# EAGLE design Eurorack_current_measure_PCB (EAGLE 7.1.0)
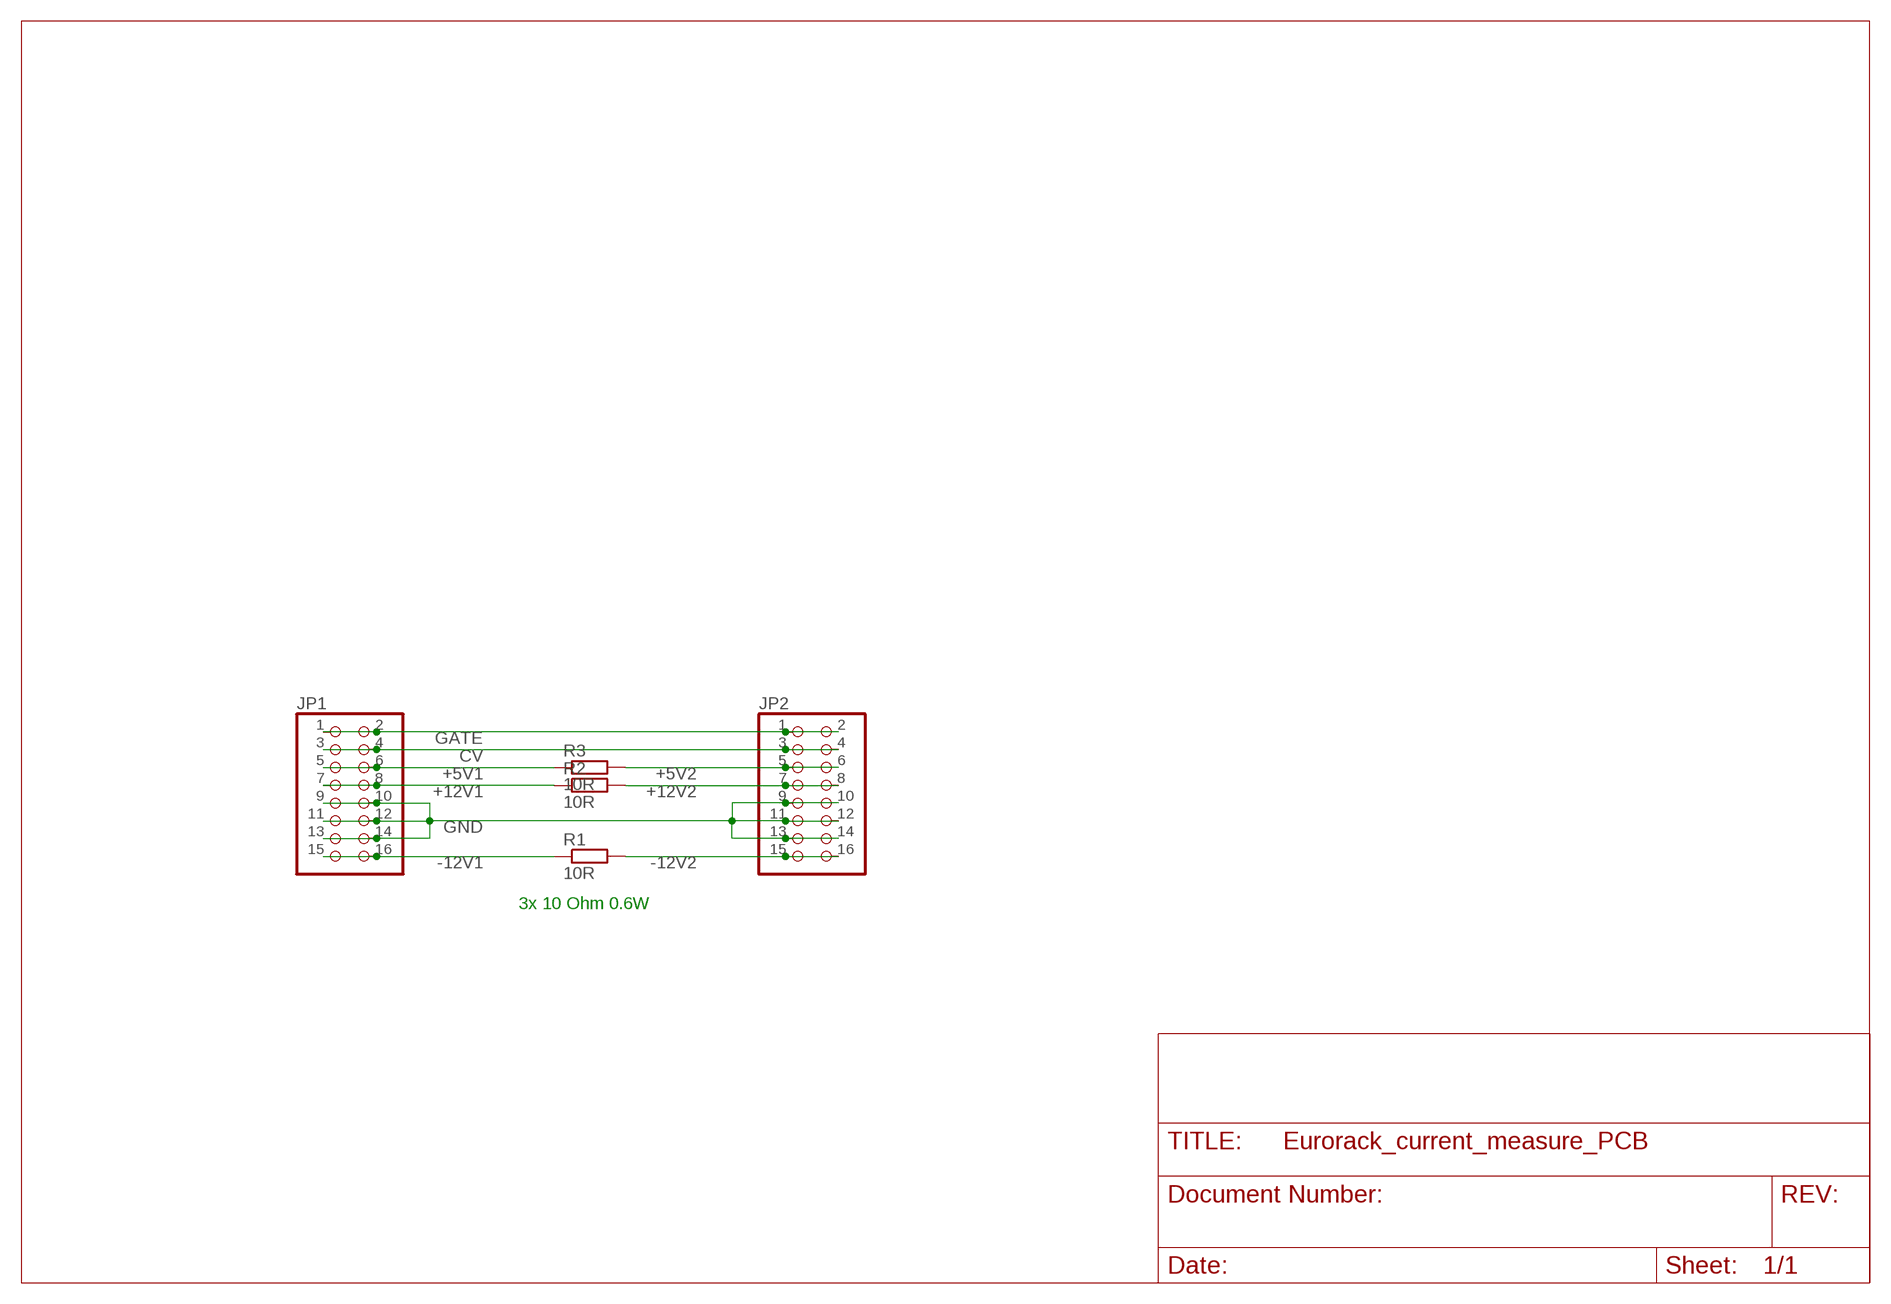
[diagram p0: schematic, sheet 1]

## Parts
JP1  PINHD-2X8  [2X08]
JP2  PINHD-2X8  [2X08]
R1  10R  R-EU_0207/10  [0207/10]
R2  10R  R-EU_0207/10  [0207/10]
R3  10R  R-EU_0207/10  [0207/10]

## Nets
+5V1: JP1.5 JP1.6 R3.1
+5V2: JP2.5 JP2.6 R3.2
+12V1: JP1.7 JP1.8 R2.1
+12V2: JP2.7 JP2.8 R2.2
-12V1: JP1.15 JP1.16 R1.1
-12V2: JP2.15 JP2.16 R1.2
CV: JP1.3 JP1.4 JP2.3 JP2.4
GATE: JP1.1 JP1.2 JP2.1 JP2.2
GND: JP1.9 JP1.10 JP1.11 JP1.12 JP1.13 JP1.14 JP2.9 JP2.10 JP2.11 JP2.12 JP2.13 JP2.14

## Notes on the sheet
- 3x 10 Ohm 0.6W

## Library data of the parts
JP1 JP2 = pinhead:PINHD-2X8: PIN HEADER
R1-R3 = rcl:R-EU_: RESISTOR, European symbol

## Board
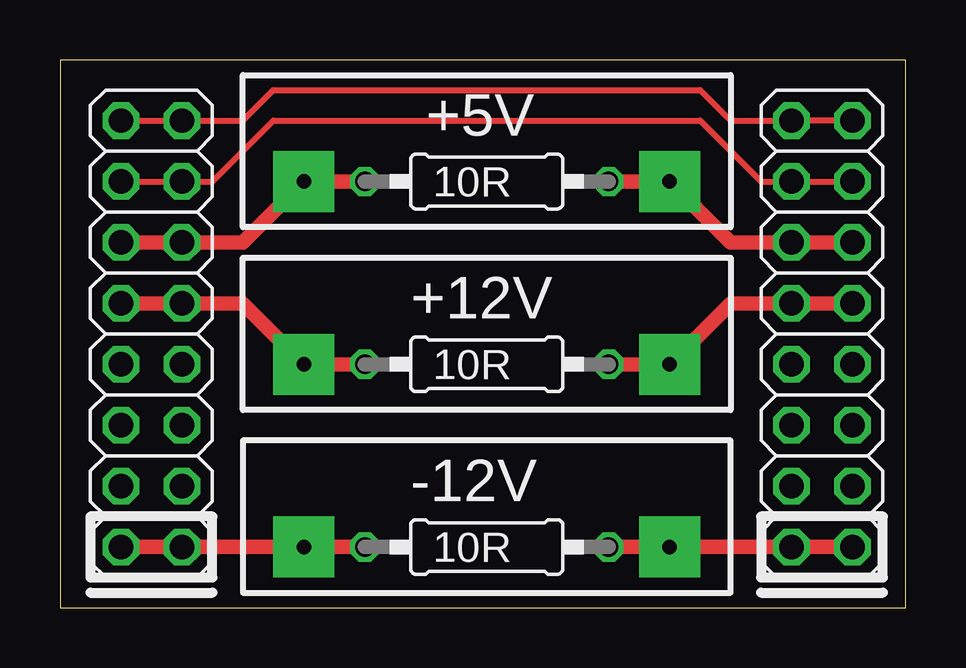
[diagram p1: board, top side]
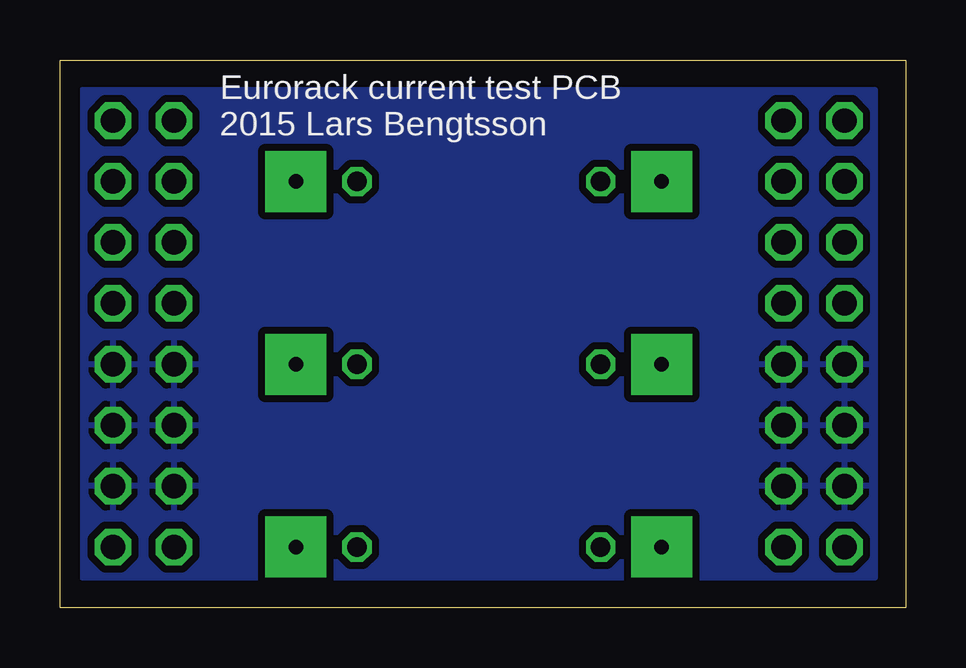
[diagram p2: board, bottom side, seen from below]

Size 35.23 x 22.85 mm. Coordinates in mm from the lower left corner, seen from the top.
Outline: 0,0 35.23,0 35.23,22.85 0,22.85 0,0
Copper layers (1*16): Top 0.0356mm / dielectric 1.5011mm / Bottom 0.0356mm
Design rules "LaenPCBOrder": minimum track width 6mil, minimum drill 13mil, track to track 6mil, track to pad 6mil, pad to pad 6mil, via to via 6mil, smd to smd 6mil, copper to edge 15mil, drill to drill 6mil, minimum pad ring 7mil, minimum via ring 7mil, stop-mask expansion 3mil, vias tented up to drill 0mil, thermal gap 10mil

### Footprints (pad centres in the part's own frame; a part is rotated, then mirrored left to right if it is on the bottom)
2X08 = drill 1.016 octagon: 1 -8.89,-1.27; 2 -8.89,1.27; 3 -6.35,-1.27; 4 -6.35,1.27; 5 -3.81,-1.27; 6 -3.81,1.27; 7 -1.27,-1.27; 8 -1.27,1.27; 9 1.27,-1.27; 10 1.27,1.27; 11 3.81,-1.27; 12 3.81,1.27; 13 6.35,-1.27; 14 6.35,1.27; 15 8.89,-1.27; 16 8.89,1.27
0207/10 = drill 0.813 octagon: 1 -5.08,0; 2 5.08,0

### Placement (x,y rotation side)
JP1  3.81,11.43 270 top
JP2  31.75,11.43 270 top
R1  17.78,2.54 0 top
R2  17.78,10.16 0 top
R3  17.78,17.78 0 top

### Tracks (layer width: path | path; a pad name or v marks a point on that pad's centre or on a via)
+5V1  (via drill 0.6 pad 2.54)
  Top 0.61: JP1.5 JP1.6 7.62,15.24 v10.16,17.78 R3.1
+5V2  (via drill 0.6 pad 2.54)
  Top 0.61: R3.2 v25.4,17.78 27.94,15.24 JP2.5 JP2.6
+12V1  (via drill 0.6 pad 2.54)
  Top 0.61: JP1.7 JP1.8 7.62,12.7 v10.16,10.16 R2.1
+12V2  (via drill 0.6 pad 2.54)
  Top 0.61: R2.2 v25.4,10.16 27.94,12.7 JP2.7 JP2.8
-12V1  (via drill 0.6 pad 2.54)
  Top 0.61: JP1.15 JP1.16 v10.16,2.54 R1.1
-12V2  (via drill 0.6 pad 2.54)
  Top 0.61: R1.2 v25.4,2.54 JP2.15 JP2.16
CV
  Top 0.254: JP1.3 JP1.4 6.35,17.78 8.89,20.32 26.67,20.32 29.21,17.78 JP2.3 JP2.4
GATE
  Top 0.254: JP1.1 JP1.2 7.62,20.32 8.89,21.59 26.67,21.59 27.94,20.32 JP2.1 JP2.2
GND
  pour Bottom (isolate 0.305): 1.27,21.59 34.29,21.59 34.29,1.27 1.27,1.27

### Text on the board
tNames: +5V | +12V | -12V
bNames: Eurorack current test PCB / 2015 Lars Bengtsson